# Altium schematic sheet Sheet1.SchDoc
size A4
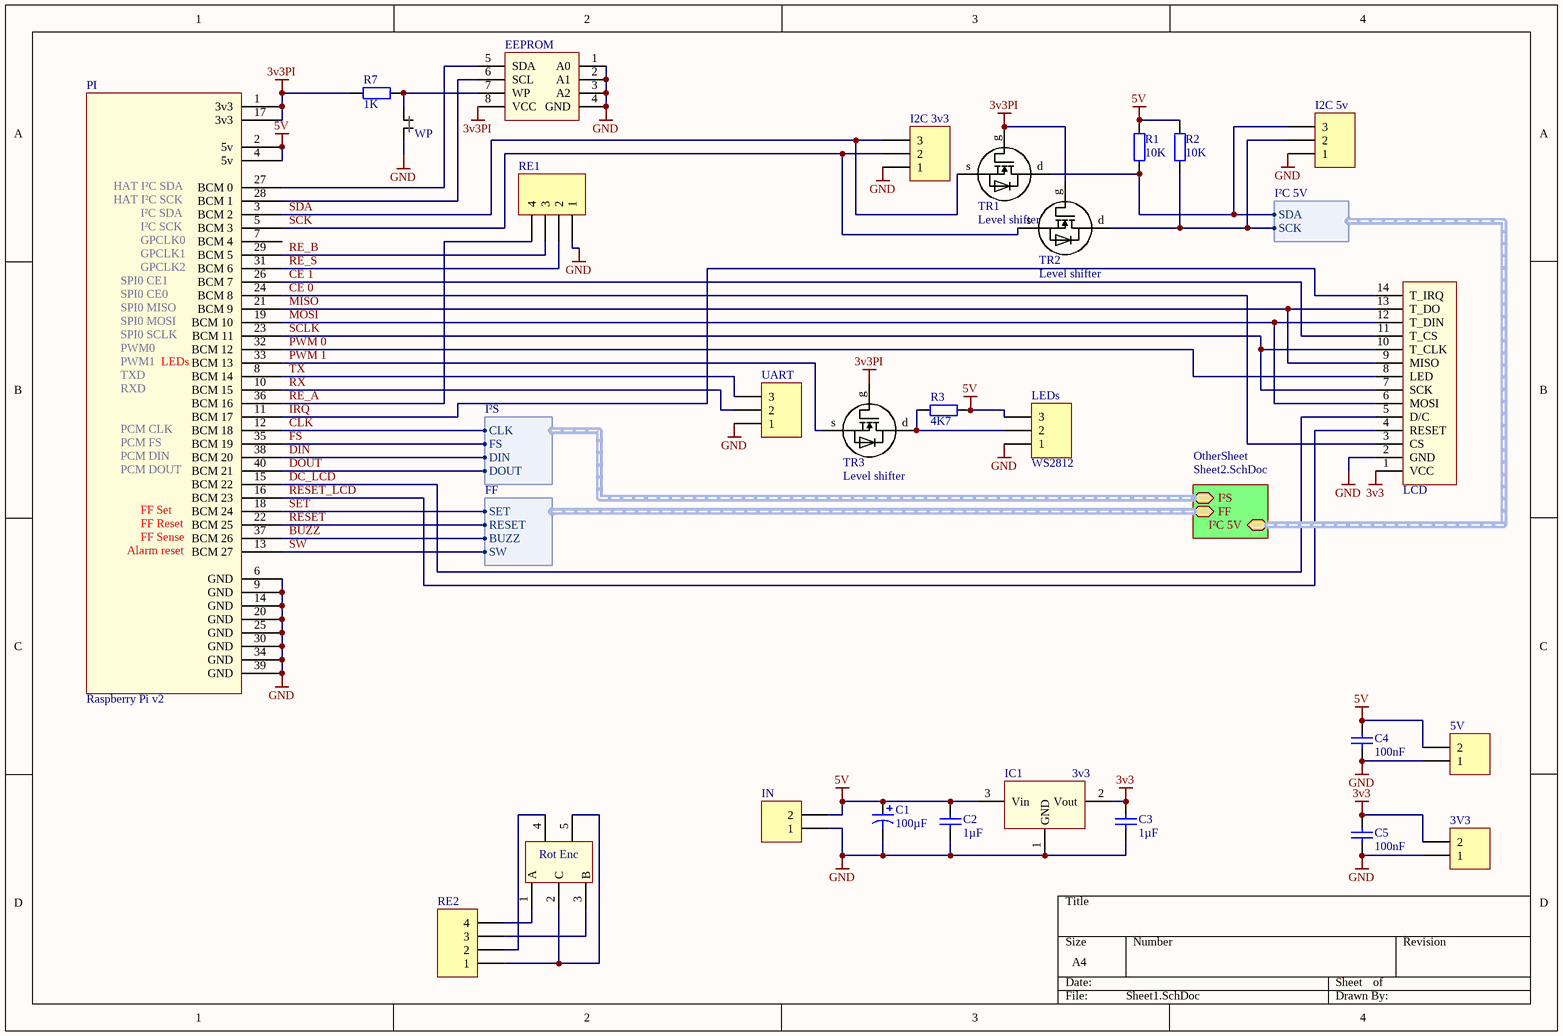
[diagram p0: Sheet1.SchDoc]

## Parts
3V3  (no value)  [HDR1X2]
5V  (no value)  [HDR1X2]
C1  value 100µF  [SMD cap 6x5]
C2  value 1µF  [C0805]
C3  value 1µF  [C0805]
C4  value 100nF  [C0805]
C5  value 100nF  [C0805]
EEPROM  I²C SERIAL EEPROM  [SOIC-8]  (value not drawn)
I2C_3v3  (no value)  [HDR1X3]
I2C_5v  (no value)  [HDR1X3]
IC1  3v3  [SOT-23A]
IN  (no value)  [HDR1X2]
LCD  TJCTM24024-SPI  (value not drawn)
LEDs  WS2812  [HDR1X3]
PI  Raspberry Pi v2  [HDR2x10]
R1  value 10K  [C1206]
R2  value 10K  [C1206]
R3  value 4K7  [C1206]
R7  value 1K  [C1206]
RE  (no value)  [EC11E-WP]
RE1  RotaryEncoder  [HDR1X4]  (value not drawn)
RE2  RotaryEncoder  [HDR1X4]  (value not drawn)
TR1  Level shifter  [SOT-23A]
TR2  Level shifter  [SOT-23A]
TR3  Level shifter  [SOT-23A]
UART  (no value)  [HDR1X3]
WP  Jumper  [HDR1X2]  (value not drawn)

## Sub-sheets
OtherSheet = Sheet2.SchDoc: FF (harness FF), I²S (harness I²S), I²C 5V (harness I²C 5V)

## Harnesses
I²S: CLK, FS, DIN, DOUT
I²C 5V: SDA, SCK
FF: SET, RESET, BUZZ, SW

## Nets
3v3: 3V3.2 C3.2 C5.1 IC1.2(Vout) LCD.1(VCC)
3v3PI: EEPROM.8(VCC) PI.1(3v3) PI.17(3v3) R7.2 TR1.g TR2.g TR3.g
5V: 5V.2 C1.1 C2.2 C4.2 IC1.3(Vin) IN.2 LEDs.3 PI.2(5v) PI.4(5v) R1.2 R2.2 R3.1
GND: 3V3.1 5V.1 C1.2 C2.1 C3.1 C4.1 C5.2 EEPROM.1(A0) EEPROM.2(A1) EEPROM.3(A2) EEPROM.4(GND) I2C_3v3.1 I2C_5v.1 IC1.1(GND) IN.1 LCD.2(GND) LEDs.1 PI.6(GND) PI.9(GND) PI.14(GND) PI.20(GND) PI.25(GND) PI.30(GND) PI.34(GND) PI.39(GND) RE1.1 UART.1 WP.1
BUZZ: PI.37(BCM_26) ; sheet OtherSheet/FF.BUZZ
CE 0: LCD.3(CS) PI.24(BCM_8)
CE 1: LCD.11(T_CS) PI.26(BCM_7)
CLK: PI.12(BCM_18) ; sheet OtherSheet/I²S.CLK
DC_LCD: LCD.5(D/C) PI.15(BCM_22)
DIN: PI.38(BCM_20) ; sheet OtherSheet/I²S.DIN
DOUT: PI.40(BCM_21) ; sheet OtherSheet/I²S.DOUT
FS: PI.35(BCM_19) ; sheet OtherSheet/I²S.FS
IRQ: LCD.14(T_IRQ) PI.11(BCM_17)
MISO: LCD.9(MISO) LCD.13(T_DO) PI.21(BCM_9)
MOSI: LCD.6(MOSI) LCD.12(T_DIN) PI.19(BCM_10)
PWM 0: LCD.8(LED) PI.32(BCM_12)
PWM 1: PI.33(BCM_13) TR3.s
RE_A: PI.36(BCM_16) RE1.4
RE_B: PI.29(BCM_5) RE1.3
RE_S: PI.31(BCM_6) RE1.2
RESET: PI.22(BCM_25) ; sheet OtherSheet/FF.RESET
RESET_LCD: LCD.4(RESET) PI.16(BCM_23)
RX: PI.10(BCM_15) UART.2
SCK: I2C_3v3.2 PI.5(BCM_3) TR2.s
SCLK: LCD.7(SCK) LCD.10(T_CLK) PI.23(BCM_11)
SDA: I2C_3v3.3 PI.3(BCM_2) TR1.s
SET: PI.18(BCM_24) ; sheet OtherSheet/FF.SET
SW: PI.13(BCM_27) ; sheet OtherSheet/FF.SW
TX: PI.8(BCM_14) UART.3
NetEEPROM_5: EEPROM.5(SDA) PI.27(BCM_0)
NetEEPROM_6: EEPROM.6(SCL) PI.28(BCM_1)
NetEEPROM_7: EEPROM.7(WP) R7.1 WP.2
NetI2C_5v_2: I2C_5v.2 R2.1 TR2.d ; sheet OtherSheet/I²C 5V.SCK
NetI2C_5v_3: I2C_5v.3 R1.1 TR1.d ; sheet OtherSheet/I²C 5V.SDA
NetLEDs_2: LEDs.2 R3.2 TR3.d
NetRE_1: RE.1(A) RE2.4
NetRE_2: RE.2(C) RE.5(F) RE2.1
NetRE_3: RE.3(B) RE2.3
NetRE_4: RE.4(E) RE2.2

Not connected (* = marked no-connect by the designer): PI 7(BCM_4)

## Notes on the sheet
- LEDs
- FF Set
- (near PI) Alarm reset
- (near PI) FF Sense
- (near PI) FF Reset
- (in symbol RaspberryPiV2) HAT I²C SDA; HAT I²C SCK; I²C SDA; I²C SCK; GPCLK0; GPCLK1; GPCLK2; SPI0 CE1; SPI0 CE0; SPI0 MISO; SPI0 MOSI; SPI0 SCLK; PWM0; PWM1; TXD; RXD; PCM CLK; PCM FS; PCM DIN; PCM DOUT
- (in symbol RotaryEncoder) Rot Enc

## Library data of the parts
3V3 5V IN = Header 2: Header, 2-Pin; LatestRevisionDate: 17-Jul-2002; LatestRevisionNote: Re-released for DXP Platform.; Publisher: Altium Limited
C1 = Cap Pol1: Polarized Capacitor (Radial); Published: 8-Jun-2000; LatestRevisionDate: 17-Jul-2002; LatestRevisionNote: Re-released for DXP Platform.; PackageReference: RB7.6-15; Publisher: Altium Limited; PackageDescription: Polarized Capacitor (Radial); 2 Leads
C2-C5 = Cap: Capacitor; Published: 8-Jun-2000; LatestRevisionDate: 17-Jul-2002; LatestRevisionNote: Re-released for DXP Platform.; PackageReference: RAD-0.3; Publisher: Altium Limited; PackageDescription: Radial Cap, Thru-Hole; 2 Leads; 0.3 in Pin Spacing
I2C_3v3 I2C_5v LEDs UART = Header 3: Header, 3-Pin; LatestRevisionDate: 17-Jul-2002; LatestRevisionNote: Re-released for DXP Platform.; Publisher: Altium Limited
IC1 = MCP1703: Power regulator
LCD = TJCTM24024-SPI: LCD module
PI = RaspberryPiV2: Raspberry Pi v2 Header
R1-R3 R7 = Res2: Resistor; Published: 8-Jun-2000; LatestRevisionDate: 17-Jul-2002; LatestRevisionNote: Re-released for DXP Platform.; PackageReference: AXIAL-0.4; Publisher: Altium Limited; PackageDescription: Axial Device, Thru-Hole; 2 Leads; 0.4 in Pin Spacing
RE = RotaryEncoder
RE1 RE2 = Header 4: Header, 4-Pin; LatestRevisionDate: 17-Jul-2002; LatestRevisionNote: Re-released for DXP Platform.; Publisher: Altium Limited
TR1-TR3 = AN10441: pin to pad: d>3 g>1 s>2